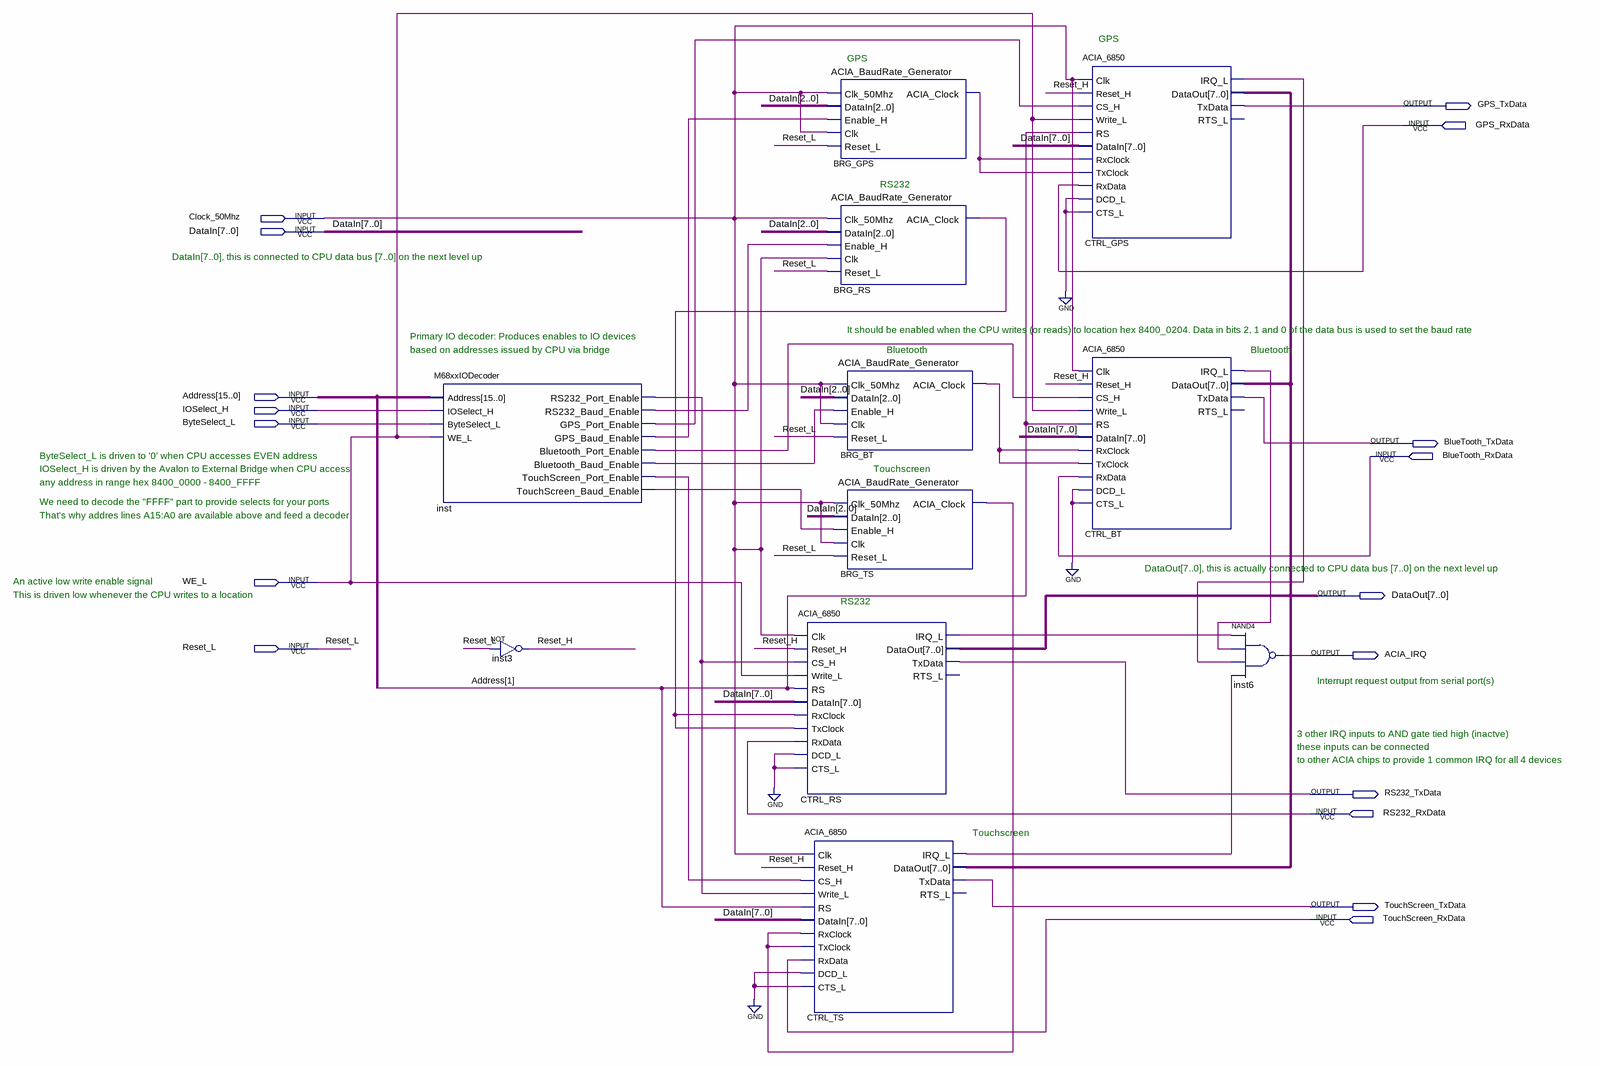
[diagram p0: schematic sheet]
// Quartus schematic OnChipM68xxIO.bdf as structural Verilog: 11 symbols, 17 pins
module OnChipM68xxIO (
  input  GPS_RxData,
  input  Clock_50Mhz,
  input  [7:0] DataIn,
  input  [15:0] Address,
  input  IOSelect_H,
  input  ByteSelect_L,
  input  BlueTooth_RxData,
  input  WE_L,
  input  Reset_L,
  input  RS232_RxData,
  input  TouchScreen_RxData,
  output GPS_TxData,
  output BlueTooth_TxData,
  output [7:0] DataOut,
  output ACIA_IRQ,
  output RS232_TxData,
  output TouchScreen_TxData
);

  wire BRG_BT_acia_clock, BRG_GPS_acia_clock, BRG_RS_acia_clock, BRG_TS_acia_clock, CTRL_BT_irq_l,
       CTRL_GPS_irq_l, CTRL_RS_irq_l, CTRL_TS_irq_l, inst_bluetooth_baud_enable, inst_bluetooth_port_enable,
       inst_gps_baud_enable, inst_gps_port_enable, inst_rs232_baud_enable, inst_rs232_port_enable,
       inst_touchscreen_baud_enable, inst_touchscreen_port_enable, Reset_H;

  M68xxIODecoder inst (
    .Address(Address), .IOSelect_H(IOSelect_H), .ByteSelect_L(ByteSelect_L), .WE_L(WE_L),
    .RS232_Port_Enable(inst_rs232_port_enable), .RS232_Baud_Enable(inst_rs232_baud_enable),
    .GPS_Port_Enable(inst_gps_port_enable), .GPS_Baud_Enable(inst_gps_baud_enable),
    .Bluetooth_Port_Enable(inst_bluetooth_port_enable), .Bluetooth_Baud_Enable(inst_bluetooth_baud_enable),
    .TouchScreen_Port_Enable(inst_touchscreen_port_enable),
    .TouchScreen_Baud_Enable(inst_touchscreen_baud_enable));
  not inst3 (Reset_H, Reset_L);
  ACIA_BaudRate_Generator BRG_GPS (
    .Clk_50Mhz(Clock_50Mhz), .DataIn(DataIn[2:0]), .Enable_H(inst_gps_baud_enable), .Clk(Clock_50Mhz),
    .Reset_L(Reset_L), .ACIA_Clock(BRG_GPS_acia_clock));
  ACIA_BaudRate_Generator BRG_RS (
    .Clk_50Mhz(Clock_50Mhz), .DataIn(DataIn[2:0]), .Enable_H(inst_rs232_baud_enable), .Clk(Clock_50Mhz),
    .Reset_L(Reset_L), .ACIA_Clock(BRG_RS_acia_clock));
  ACIA_6850 CTRL_RS (
    .Clk(Clock_50Mhz), .Reset_H(Reset_H), .CS_H(inst_rs232_port_enable), .Write_L(WE_L), .RS(Address[1]),
    .DataIn(DataIn), .RxClock(BRG_RS_acia_clock), .TxClock(BRG_RS_acia_clock), .RxData(RS232_RxData),
    .DCD_L(1'b0), .CTS_L(1'b0), .IRQ_L(CTRL_RS_irq_l), .DataOut(DataOut), .TxData(RS232_TxData));  // open: RTS_L
  ACIA_6850 CTRL_TS (
    .Clk(Clock_50Mhz), .Reset_H(Reset_H), .CS_H(inst_touchscreen_port_enable),
    .Write_L(inst_rs232_port_enable), .RS(Address[1]), .DataIn(DataIn), .RxClock(BRG_TS_acia_clock),
    .TxClock(BRG_TS_acia_clock), .RxData(TouchScreen_RxData), .DCD_L(1'b0), .CTS_L(1'b0),
    .IRQ_L(CTRL_TS_irq_l), .DataOut(DataOut), .TxData(TouchScreen_TxData));  // open: RTS_L
  ACIA_BaudRate_Generator BRG_BT (
    .Clk_50Mhz(Clock_50Mhz), .DataIn(DataIn[2:0]), .Enable_H(inst_bluetooth_baud_enable), .Clk(Clock_50Mhz),
    .Reset_L(Reset_L), .ACIA_Clock(BRG_BT_acia_clock));
  ACIA_BaudRate_Generator BRG_TS (
    .Clk_50Mhz(Clock_50Mhz), .DataIn(DataIn[2:0]), .Enable_H(inst_touchscreen_baud_enable),
    .Clk(Clock_50Mhz), .Reset_L(Reset_L), .ACIA_Clock(BRG_TS_acia_clock));
  ACIA_6850 CTRL_GPS (
    .Clk(Clock_50Mhz), .Reset_H(Reset_H), .CS_H(inst_gps_port_enable), .Write_L(WE_L), .RS(Address[1]),
    .DataIn(DataIn), .RxClock(BRG_GPS_acia_clock), .TxClock(BRG_GPS_acia_clock), .RxData(GPS_RxData),
    .DCD_L(1'b0), .CTS_L(1'b0), .IRQ_L(CTRL_GPS_irq_l), .DataOut(DataOut), .TxData(GPS_TxData));  // open: RTS_L
  ACIA_6850 CTRL_BT (
    .Clk(Clock_50Mhz), .Reset_H(Reset_H), .CS_H(inst_bluetooth_port_enable), .Write_L(WE_L), .RS(Address[1]),
    .DataIn(DataIn), .RxClock(BRG_BT_acia_clock), .TxClock(BRG_BT_acia_clock), .RxData(BlueTooth_RxData),
    .DCD_L(1'b0), .CTS_L(1'b0), .IRQ_L(CTRL_BT_irq_l), .DataOut(DataOut), .TxData(BlueTooth_TxData));  // open: RTS_L
  nand inst6 (ACIA_IRQ, CTRL_RS_irq_l, CTRL_BT_irq_l, CTRL_GPS_irq_l, CTRL_TS_irq_l);

  // Notes on the sheet:
  //   GPS
  //   GPS
  //   RS232
  //   DataIn[7..0], this is connected to CPU data bus [7..0] on the next level up
  //   It should be enabled when the CPU writes (or reads) to location hex 8400_0204. Data in bits 2, 1 and 0 of the data bus is used to set the baud rate
  //   Primary IO decoder: Produces enables to IO devices
  //   based on addresses issued by CPU via bridge
  //   Bluetooth
  //   Bluetooth
  //   ByteSelect_L is driven to '0' when CPU accesses EVEN address
  //   IOSelect_H is driven by the Avalon to External Bridge when CPU access
  //   Touchscreen
  //   any address in range hex 8400_0000 - 8400_FFFF
  //   We need to decode the "FFFF" part to provide selects for your ports 
  //   That's why addres lines A15:A0 are available above and feed a decoder
  //   DataOut[7..0], this is actually connected to CPU data bus [7..0] on the next level up
  //   An active low write enable signal
  //   This is driven low whenever the CPU writes to a location
  //   RS232
  //   Interrupt request output from serial port(s)
  //   3 other IRQ inputs to AND gate tied high (inactve)
  //   these inputs can be connected
  //   to other ACIA chips to provide 1 common IRQ for all 4 devices
  //   Touchscreen
endmodule
